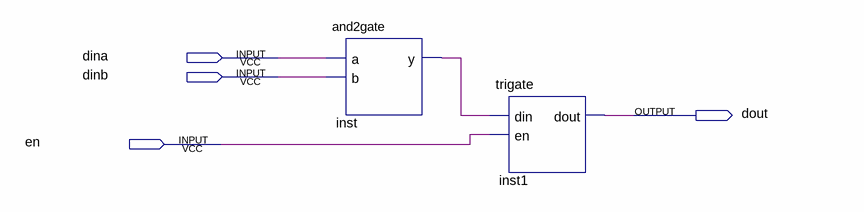
[diagram p0: schematic sheet]
// Quartus schematic tri_and_gate.bdf as structural Verilog: 2 symbols, 4 pins
module tri_and_gate (
  input  dina,
  input  dinb,
  input  en,
  output dout
);

  wire inst_y;

  and2gate inst (.a(dina), .b(dinb), .y(inst_y));
  trigate inst1 (.din(inst_y), .en(en), .dout(dout));
endmodule
